# Altium schematic sheet RFID_Reader.SchDoc
size A4
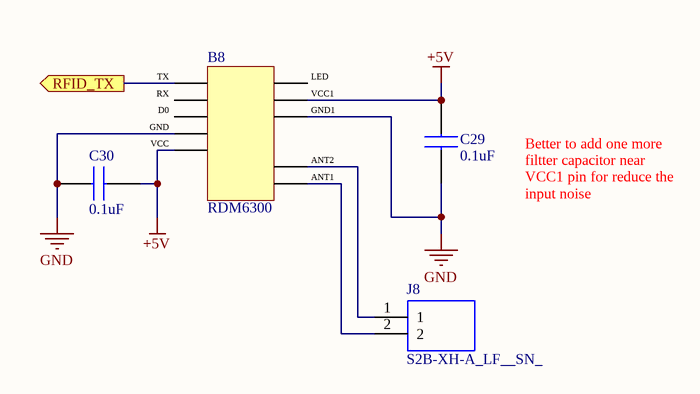
[diagram p0: RFID_Reader.SchDoc]

## Parts
B8  RDM6300  [RDM6300]
C29  0.1uF  [CAPC1005X55N]
C30  0.1uF  [CAPC1005X55N]
J8  S2B-XH-A_LF__SN_  [SHDRRA2W80P0X250_1X2_740X1150X610P]

## Ports
RFID_TX (out)

## Nets
+5V: B8.VCC B8.VCC1 C29.1 C30.2
GND: B8.GND B8.GND1 C29.2 C30.1
RFID_TX: B8.TX ; port RFID_TX
NetB8_ANT1: B8.ANT1 J8.2
NetB8_ANT2: B8.ANT2 J8.1

Not connected (* = marked no-connect by the designer): B8 D0 LED RX

## Notes on the sheet
- Better to add one more filtter capacitor near VCC1 pin for reduce the input noise

## Library data of the parts
B8 = RDM6300: RFID READER R/W 125KHZ MODULE
C29 = C0402C104M4RECTU: CAP CER 0.1UF 6.3V X7R 0402; Manufacturer_Name: Kemet; Manufacturer_Part_Number: 0402B104K6R3CT; Geometry.Height: 0.55mm; Arrow Part Number: 0402B104K6R3CT; Arrow Price/Stock: *; Mouser Part Number: 80-C0402C104M4RECTU; Mouser Price/Stock: https://www.mouser.com/Search/Refine.aspx?Keyword=80-C0402C104M4RECTU; Datasheet Link: https://content.kemet.com/datasheets/KEM_C1002_X7R_SMD.pdf
C30 = C0402C104M4RECTU: Multilayer Ceramic Capacitors MLCC - SMD/SMT 16V 0.1uF X7R 0402 20%; Manufacturer_Name: Kemet; Geometry.Height: 0.55mm; Manufacturer_Part_Number: C0402C104M4RECTU; Arrow Part Number: C0402C104M4RECTU; Arrow Price/Stock: *; Mouser Part Number: 80-C0402C104M4RECTU; Mouser Price/Stock: https://www.mouser.com/Search/Refine.aspx?Keyword=80-C0402C104M4RECTU; Datasheet Link: https://content.kemet.com/datasheets/KEM_C1002_X7R_SMD.pdf
J8 = S2B-XH-A_LF__SN_: XH-2.5mm Header side entry 2 way JST XH Series, Series Number S2B, 2.5mm Pitch 2 Way 1 Row Right Angle PCB Header, Solder Termination, 3A; Manufacturer_Name: JST (JAPAN SOLDERLESS TERMINALS); Manufacturer_Part_Number: S2B-XH-A(LF)(SN); Geometry.Height: 6.1mm; Arrow Part Number: S2B-XH-A(LF)(SN); Arrow Price/Stock: https://www.arrow.com/en/products/s2b-xh-a-lf-sn/jst-manufacturing; Mouser Part Number: *; Mouser Price/Stock: *; Datasheet Link: http://www.jst-mfg.com/product/pdf/eng/eXH.pdf